# EAGLE design LightTable_Borders_CurrentMirrorSinglePiece (EAGLE 9.6.2)
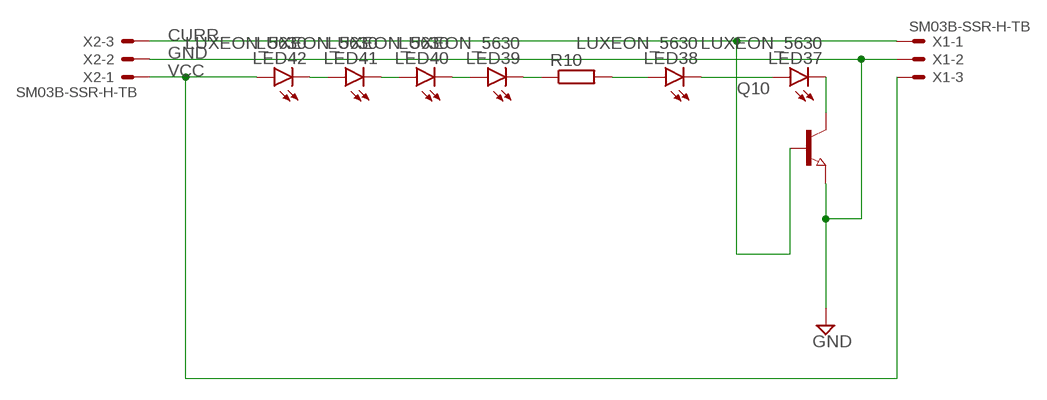
[diagram p0: schematic, sheet 1]

## Parts
LED37  LUXEON_5630  [LUXEON_5630]
LED38  LUXEON_5630  [LUXEON_5630]
LED39  LUXEON_5630  [LUXEON_5630]
LED40  LUXEON_5630  [LUXEON_5630]
LED41  LUXEON_5630  [LUXEON_5630]
LED42  LUXEON_5630  [LUXEON_5630]
Q10  NPN-TRANSISTOR_SOT23  [SOT23]
R10  R-EU_R0805  [R0805]
X1  SM03B-SSR-H-TB  [SM03B-SSR-H-TB]
X2  SM03B-SSR-H-TB  [SM03B-SSR-H-TB]

## Nets
CURR: Q10.1(B) X1.1 X2.3
GND: Q10.2(E) X1.2 X2.2
N$1: LED39.1@1(C) LED39.1@2(C) R10.1
N$2: LED38.2(A) R10.2
N$3: LED37.2(A) LED38.1@1(C) LED38.1@2(C)
N$58: LED37.1@1(C) LED37.1@2(C) Q10.3(C)
N$62: LED39.2(A) LED40.1@1(C) LED40.1@2(C)
N$63: LED40.2(A) LED41.1@1(C) LED41.1@2(C)
N$64: LED41.2(A) LED42.1@1(C) LED42.1@2(C)
VCC: LED42.2(A) X1.3 X2.1

## Library data of the parts
LED37-LED42 = led:LUXEON_5630: LUXEON 5630 Mid-Power LEDs SD201 Source: Data sheet <www.philipslumileds.com/uploads/351/DS201-pdf> Lumileds 5630 Datasheet DS201 20130228 ©2013 Philips Lumileds Lighting Company.
Q10 = semicon-smd-ipc:NPN-TRANSISTOR_: NPN TRANSISTOR
R10 = rcl:R-EU_: RESISTOR, European symbol; SPICEPREFIX: R
X1 X2 = con-jst2:SM03B-SSR-H-TB: Disconnectable Insulation displacement connector, 1.0mm pitch 3 contacts

## Board
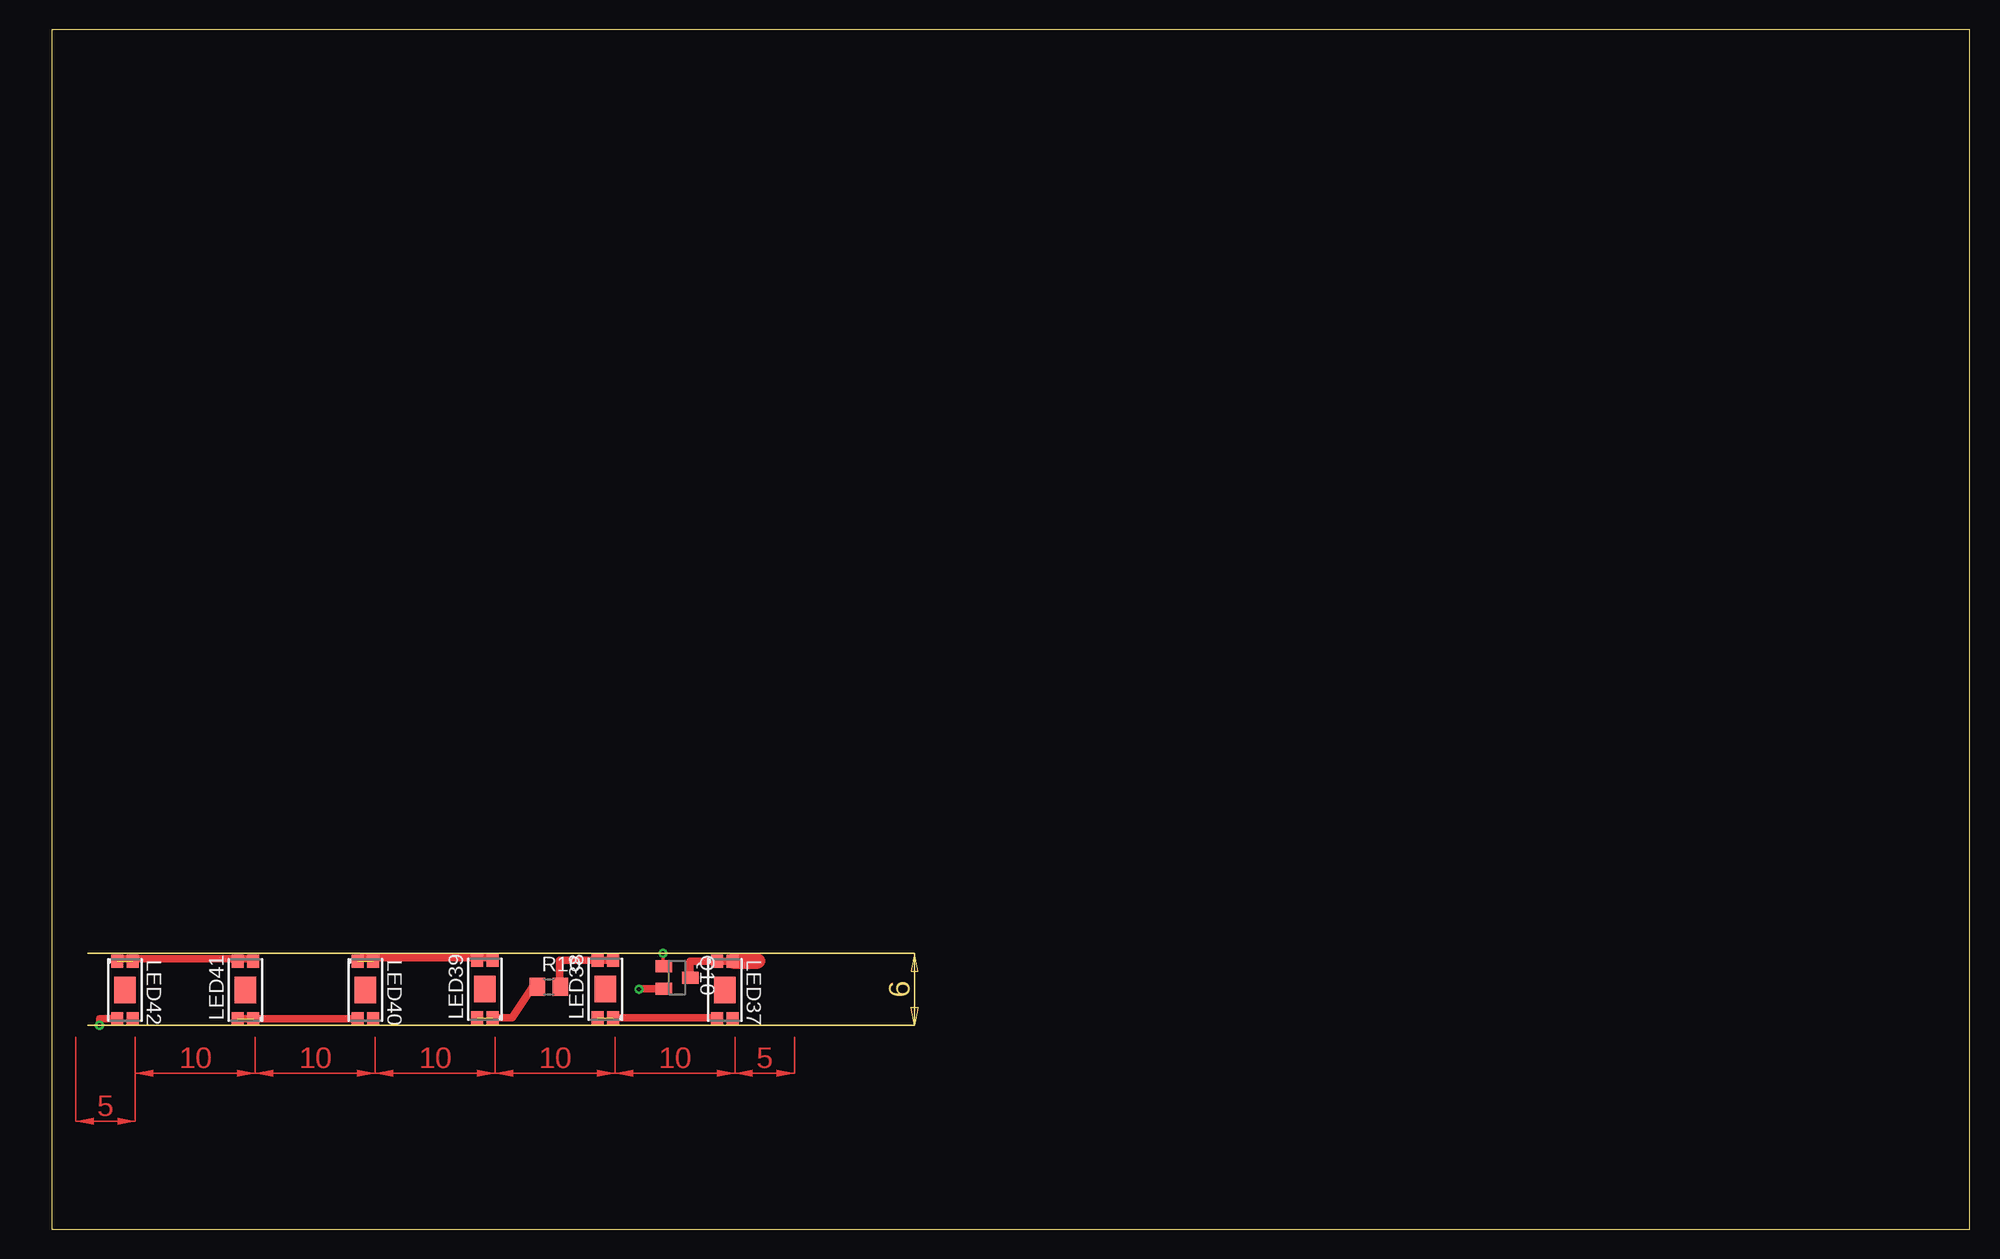
[diagram p1: board, top side]
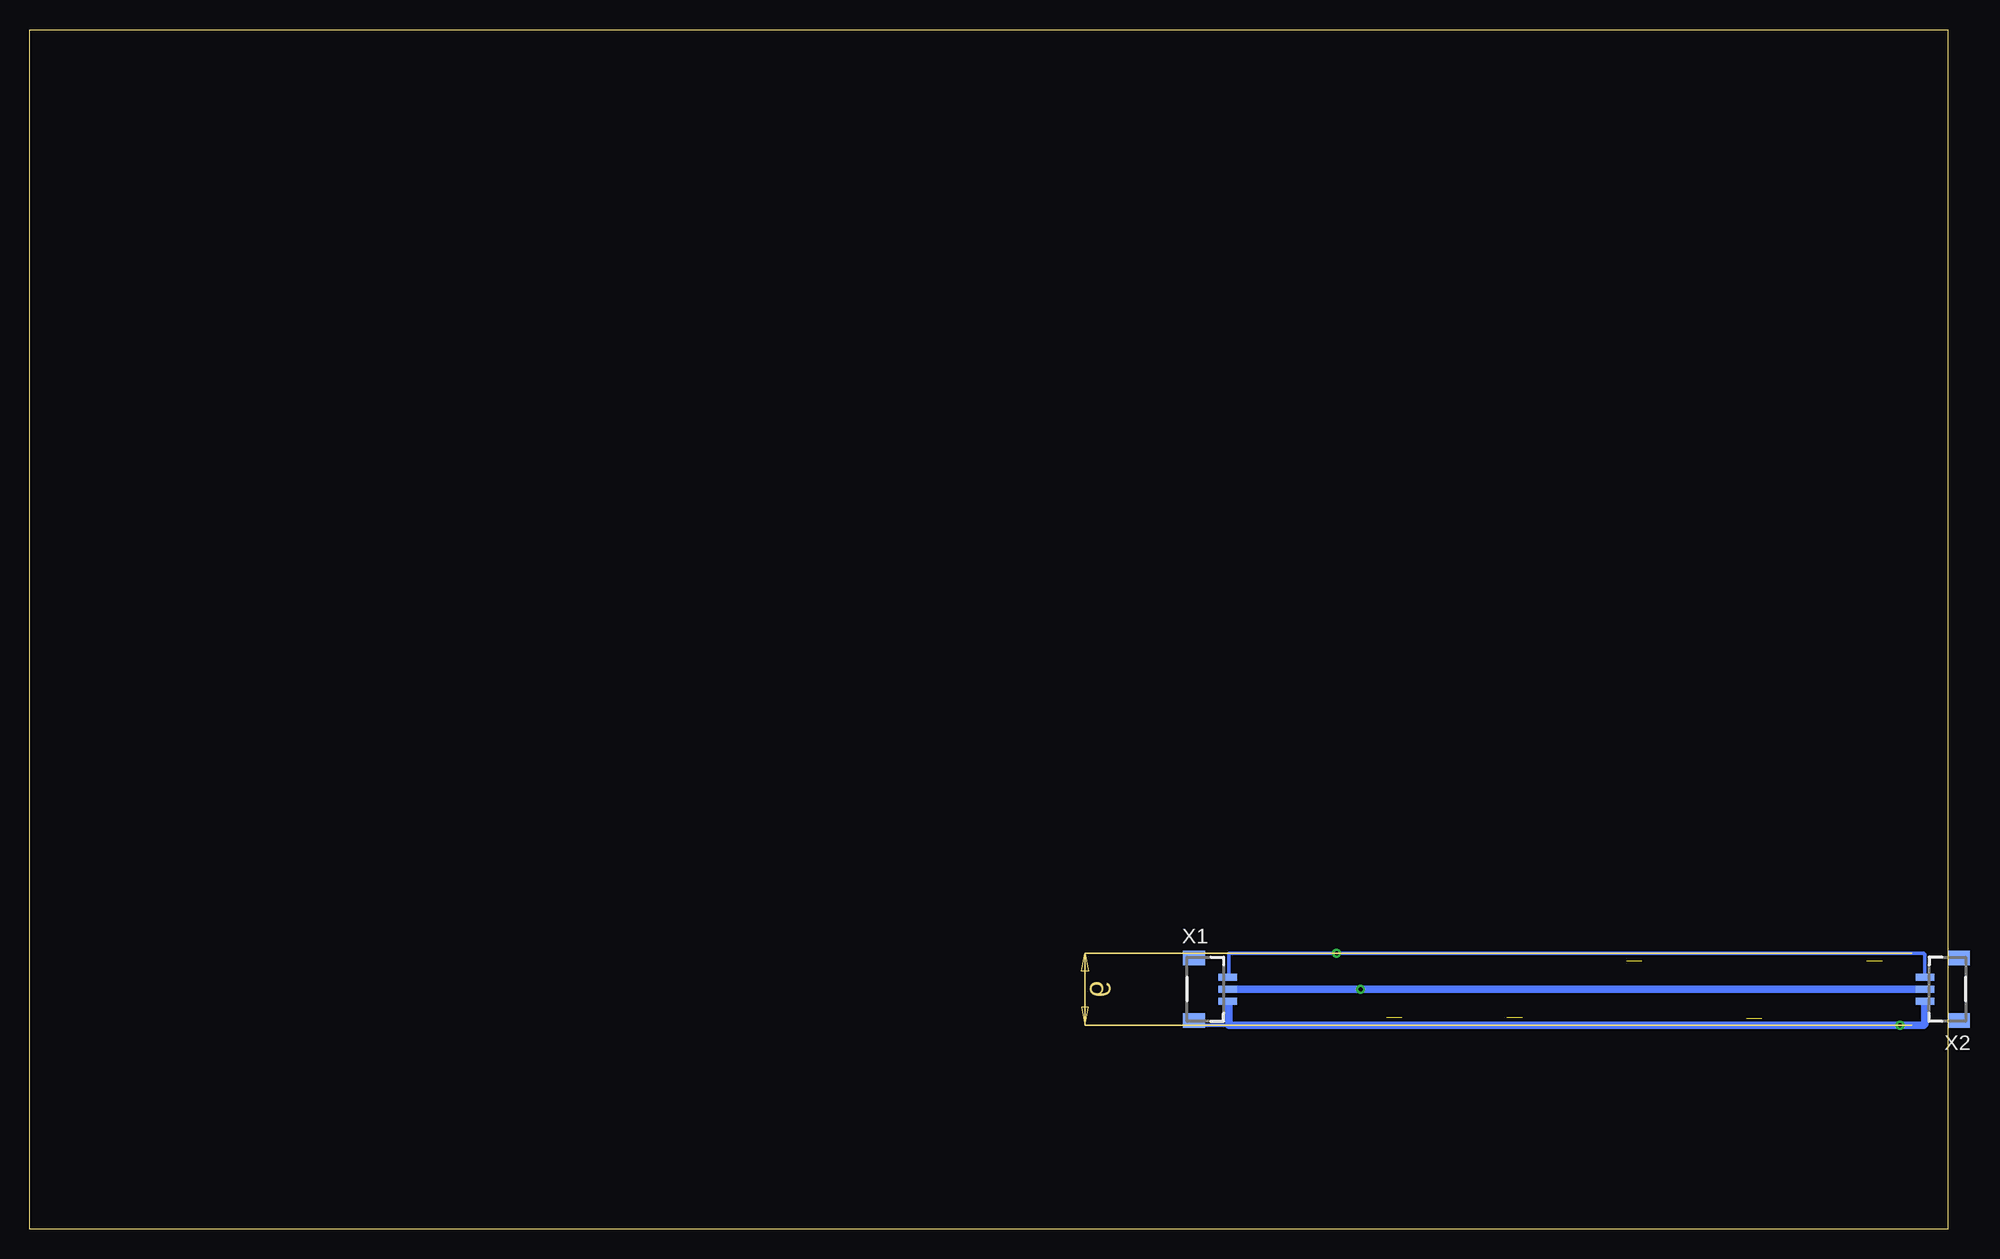
[diagram p2: board, bottom side, seen from below]

Size 160 x 100 mm. Coordinates in mm from the lower left corner, seen from the top.
Outline: 0,0 160,0 160,100 0,100 0,0
Copper layers (1*16): Top 0.035mm / dielectric 1.5mm / Bottom 0.035mm
Design rules "default": minimum track width 6mil, minimum drill 0.35mm, track to track 6mil, track to pad 6mil, pad to pad 6mil, via to via 6mil, smd to smd 6mil, copper to edge 40mil, drill to drill 6mil, minimum pad ring 10mil, minimum via ring 8mil, stop-mask expansion 4mil, vias tented up to drill 0mil, thermal gap 10mil

### Footprints (pad centres in the part's own frame; a part is rotated, then mirrored left to right if it is on the bottom)
LUXEON_5630 = smd 1.1 x 1: 1@1 -2.4,-0.65; 1@2 -2.4,0.65; 2 2.4,-0.65; 4 2.4,0.65 | smd 2.2 x 1.8: 3 0,0
SOT23 = smd 1 x 1.4: 1 -0.95,-1.1; 2 0.95,-1.1; 3 0,1.1
R0805 = smd 1.3 x 1.5: 1 -0.95,0; 2 0.95,0
SM03B-SSR-H-TB = smd 0.6 x 1.55: 1 -1,1.925; 2 0,1.925; 3 1,1.925 | smd 1.2 x 1.8: FIT@1 -2.6,-0.9; FIT@2 2.6,-0.9

### Placement (x,y rotation side)
LED37  56.17,19.94 270 top
LED38  46.19,20 90 top
LED39  36.14,20 90 top
LED40  26.19,19.94 270 top
LED41  16.16,19.94 90 top
LED42  6.13,19.94 270 top
Q10  52.18,20.97 270 top
R10  41.49,20.2 0 top
X1  62,20 270 bottom
X2  0,20 90 bottom

### Tracks (layer width: path | path; a pad name or v marks a point on that pad's centre or on a via)
CURR  (via drill 0.35)
  Top 0.3: Q10.1 51,22 v51,23
  Bottom 0.3: X2.3 1.93,22.93 2,23 v51,23 60,23 60,21 X1.1
GND  (via drill 0.35)
  Top 0.3: 49.02,20.02 v49,20
  Top 0.61: Q10.2 49.02,20.02
  Bottom 0.61: X2.2 v49,20 X1.2
N$1  (1 unrouted)
  Top 0.3: 40.17,20.27 R10.1
  Top 0.61: LED39.1@1 38.44,17.61 40.17,20.27
N$2
  Top 0.3: R10.2 42.6,20.37
  Top 0.61: LED38.2 42.39,22.41 42.39,20.25 R10.2
N$3  (1 unrouted)
  Top 0.3: LED37.2 55.45,17.61
  Top 0.61: 55.45,17.61 LED38.1@1
N$58
  Top 0.61: Q10.3 53.28,22.34 LED37.1@2 LED37.1@1
  Top 1.27: LED37.1@2 58.91,22.34 58.93,22.35
N$62  (1 unrouted)
  Top 0.3: LED40.1@1 25.82,22.61 | LED39.2 36.58,22.61
  Top 0.61: 36.58,22.61 25.82,22.61
N$63  (1 unrouted)
  Top 0.61: LED41.1@2 LED40.2
N$64  (1 unrouted)
  Top 0.3: LED41.2 16.6,22.55 | LED42.1@1 5.69,22.55
  Top 0.61: 16.6,22.55 5.69,22.55
VCC  (via drill 0.35)
  Top 0.61: LED42.2 4,17.54 v4,17
  Bottom 0.3: 63,17 60,17 | 2,17 1.93,17.07 | X1.3 60,19
  Bottom 0.61: 2,17 v4,17 60,17 60,19 | 1.93,17.07 X2.1
(copper drawn outside any net)
  shapes: Top area x7